# Altium project TruckCape v4.PrjPCB
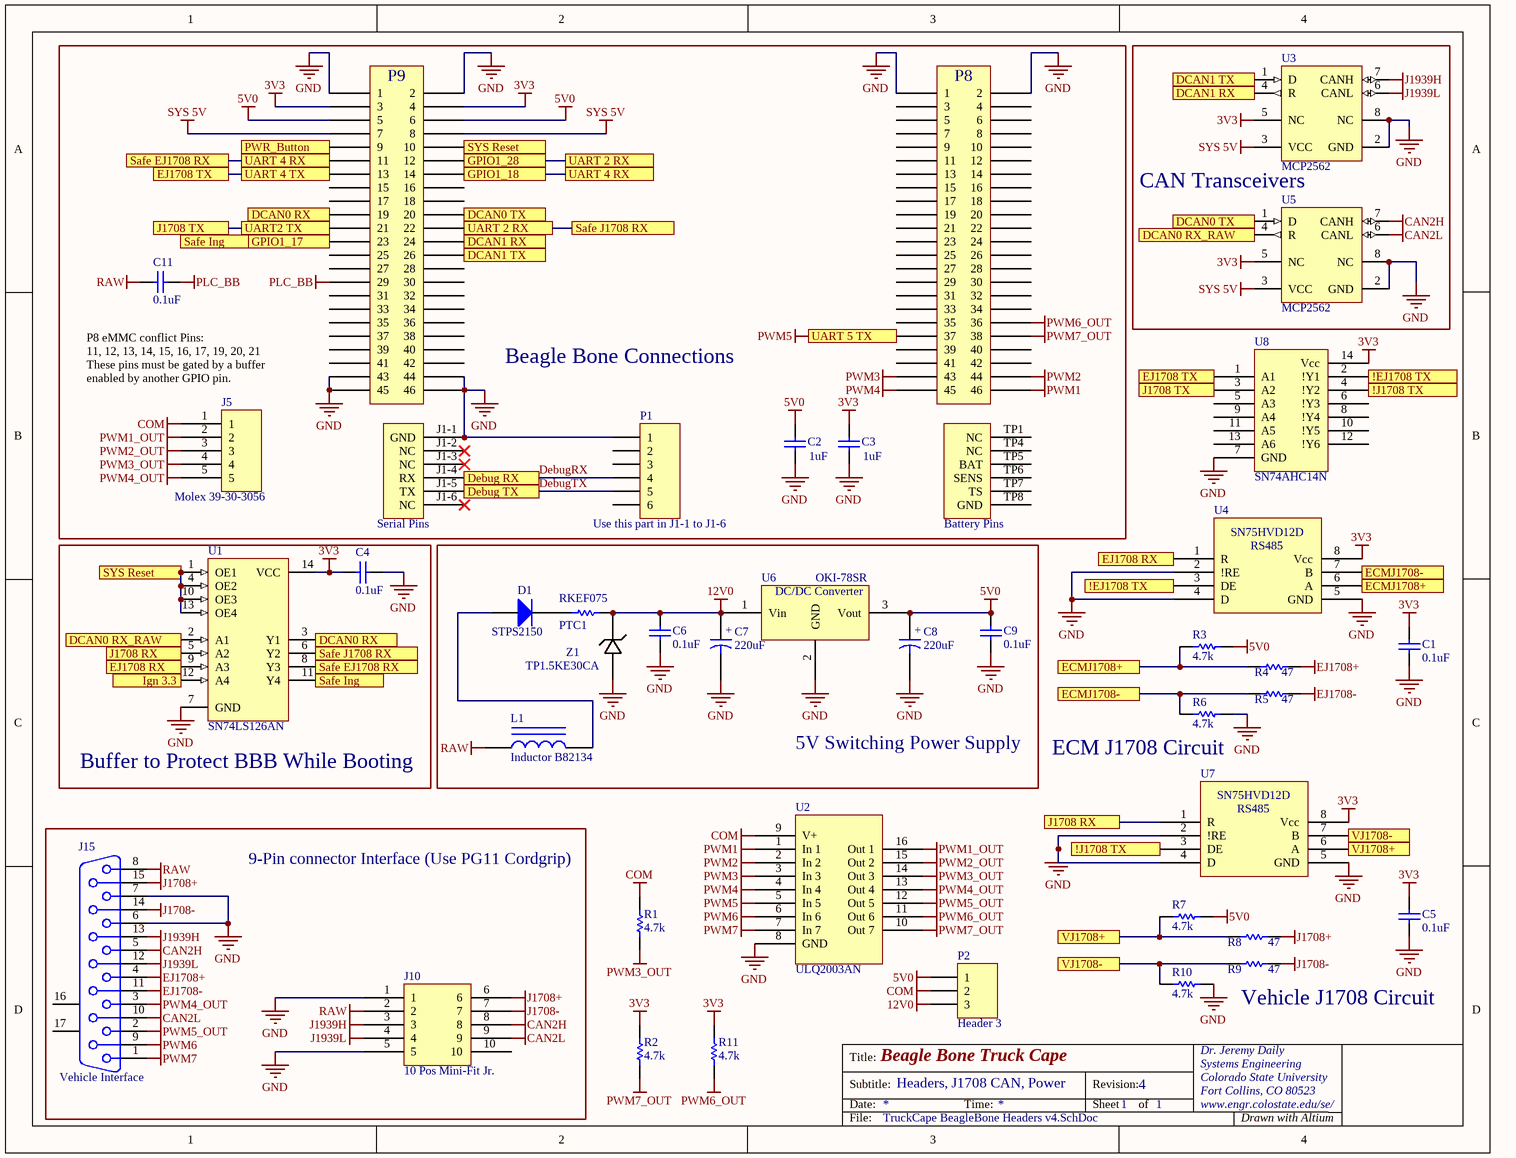
[diagram p0: TruckCape BeagleBone Headers v4.SchDoc]
1 sheet, 39 parts. Net scope: flat (ports and power ports of the same name join across sheets).
Board file: TruckCape for Hammond 1455K - Rev4.PcbDoc

## Sheet TruckCape BeagleBone Headers v4.SchDoc: Beagle Bone Truck Cape
size Letter; Author: Dr. Jeremy Daily; CompanyName: Colorado State University; Organization: Dr. Jeremy Daily; Address1: Systems Engineering; Address2: Colorado State University; Address3: Fort Collins, CO 80523; Address4: www.engr.colostate.edu/se/; DocumentNumber: Headers, J1708 CAN, Power; Revision: 4; SheetNumber: 1; SheetTotal: 1; ProjectName: NSF EAGER Testbed

### Parts
BeagleBoneBlack1  BeagleBoneBlack  [Beagleboneblack]  (value not drawn)
C1  0.1uF  [CAPR5-4X5]
C2  1uF  [CAPR5-4X5]
C3  1uF  [CAPR5-4X5]
C4  0.1uF  [CAPR5-4X5]
C5  0.1uF  [CAPR5-4X5]
C6  0.1uF  [CAPR5-4X5]
C7  220uF  [Elec. Cap 5 x 10mm]
C8  220uF  [Elec. Cap 5 x 10mm]
C9  0.1uF  [CAPR5-4X5]
C11  0.1uF  [CAPR5-4X5]
D1  STPS2150  [DO-41]
J5  Molex 39-30-3056  [5 POS MINI-FIT JR R/A Header]
J10  10 Pos Mini-Fit Jr.  [10 pos Mini-Fit Jr. R/A Header]
J15  Vehicle Interface  [DB15]
L1  Inductor B82134  [AXIAL-0.9]
P1  Use this part in J1-1 to J1-6  [HDR1X6]
P2  Header 3  [HDR1X3]
PTC1  RKEF075  [PTC]
R1  4.7k  [Axial-0.4]
R2  4.7k  [Axial-0.4]
R3  4.7k  [Axial-0.4]
R4  47  [Axial-0.4]
R5  47  [Axial-0.4]
R6  4.7k  [Axial-0.4]
R7  4.7k  [Axial-0.4]
R8  47  [Axial-0.4]
R9  47  [Axial-0.4]
R10  4.7k  [Axial-0.4]
R11  4.7k  [Axial-0.4]
U1  SN74LS126AN  [N14A]
U2  ULQ2003AN  [DIP16]
U3  MCP2562  [PDIP300-P8]
U4  SN75HVD12  [PDIP300-P8]  (value not drawn)
U5  MCP2562  [PDIP300-P8]
U6  OKI-78SR  [OKI-78SR]
U7  SN75HVD12  [PDIP300-P8]  (value not drawn)
U8  SN74AHC14N  [N14A]
Z1  TP1.5KE30CA  [DIODE-0.7]

### Blocks framed on the sheet
Beagle Bone Connections: BeagleBoneBlack1 C2 C3 C11 J5 P1
CAN Transceivers: U3 U5
Buffer to Protect BBB While Booting: C4 U1
5V Switching Power Supply: C6-C9 D1 L1 PTC1 U6 Z1
9-Pin connector Interface (Use PG11 Cordgrip): J10 J15

### Ports
!EJ1708 TX, !J1708 TX, DCAN0 RX, DCAN0 RX_RAW, DCAN0 TX, DCAN1 RX, DCAN1 TX, Debug RX, Debug TX, ECMJ1708+, ECMJ1708-, EJ1708 RX, EJ1708 TX, GPIO1_17, GPIO1_18, GPIO1_28, Ign 3.3, J1708 RX, J1708 TX, PWR_Button, Safe EJ1708 RX, Safe Ing, Safe J1708 RX, SYS Reset, UART2 TX, UART 2 RX, UART 4 RX, UART 4 TX, UART 5 TX, VJ1708+, VJ1708-

### Nets
3V3: BeagleBoneBlack1.3 BeagleBoneBlack1.4 C1.2 C3.1 C4.1 C5.2 R2.2 R11.2 U1.14(VCC) U3.5(NC) U4.8(Vcc) U5.5(NC) U7.8(Vcc) U8.14(Vcc)
5V0: BeagleBoneBlack1.5 BeagleBoneBlack1.6 C2.1 C8.1 C9.2 P2.1 R3.2 R7.2 U6.3(Vout)
12V0: C6.2 C7.1 P2.3 PTC1.2 U6.1(Vin) Z1.2(K)
CAN2H: J10.8 J15.5 U5.7(CANH)
CAN2L: J10.9 J15.10 U5.6(CANL)
COM: J5.1 P2.2 R1.2 U2.9(V+)
EJ1708+: J15.4 R4.2
EJ1708-: J15.11 R5.2
GND: BeagleBoneBlack1.1 BeagleBoneBlack1.2 BeagleBoneBlack1.43 BeagleBoneBlack1.44 BeagleBoneBlack1.45 BeagleBoneBlack1.46 BeagleBoneBlack1.J1-1(GND) BeagleBoneBlack1.P1(1) BeagleBoneBlack1.P2(2) C1.1 C2.2 C3.2 C4.2 C5.1 C6.1 C7.2(-) C8.2(-) C9.1 J10.1 J10.5 J15.6 J15.7 P1.1 R6.2 R10.2 U1.7(GND) U2.8(GND) U3.2(GND) U3.8(NC) U4.2(!RE) U4.4(D) U4.5(GND) U5.2(GND) U5.8(NC) U6.2(GND) U7.2(!RE) U7.4(D) U7.5(GND) U8.7(GND) Z1.1(A)
J1708+: J10.6 J15.15 R8.2
J1708-: J10.7 J15.14 R9.2
J1939H: J10.3 J15.13 U3.7(CANH)
J1939L: J10.4 J15.12 U3.6(CANL)
PLC_BB: BeagleBoneBlack1.29 C11.2
PWM1: BeagleBoneBlack1.P46(46) U2.1(In_1)
PWM1_OUT: J5.2 U2.16(Out_1)
PWM2: BeagleBoneBlack1.P44(44) U2.2(In_2)
PWM2_OUT: J5.3 U2.15(Out_2)
PWM3: BeagleBoneBlack1.P43(43) U2.3(In_3)
PWM3_OUT: J5.4 R1.1 U2.14(Out_3)
PWM4: BeagleBoneBlack1.P45(45) U2.4(In_4)
PWM4_OUT: J5.5 J15.3 U2.13(Out_4)
PWM5: BeagleBoneBlack1.P37(37) U2.5(In_5) ; port UART 5 TX
PWM5_OUT: J15.2 U2.12(Out_5)
PWM6: J15.9 U2.6(In_6)
PWM6_OUT: BeagleBoneBlack1.P36(36) R11.1 U2.11(Out_6)
PWM7: J15.1 U2.7(In_7)
PWM7_OUT: BeagleBoneBlack1.P38(38) R2.1 U2.10(Out_7)
RAW: C11.1 J10.2 J15.8 L1.1
SYS 5V: BeagleBoneBlack1.7 BeagleBoneBlack1.8 U3.3(VCC) U5.3(VCC)
DebugRX: BeagleBoneBlack1.J1-4(RX) P1.4 ; port Debug RX
DebugTX: BeagleBoneBlack1.J1-5(TX) P1.5 ; port Debug TX
NetBeagleBoneBlack1_9: BeagleBoneBlack1.9 ; port PWR_Button
NetBeagleBoneBlack1_10: BeagleBoneBlack1.10 U1.1(OE1) U1.4(OE2) U1.10(OE3) U1.13(OE4) ; port SYS Reset
NetBeagleBoneBlack1_11: BeagleBoneBlack1.11 BeagleBoneBlack1.14 U1.8(Y3) ; port UART 4 RX, port GPIO1_18, port Safe EJ1708 RX
NetBeagleBoneBlack1_12: BeagleBoneBlack1.12 BeagleBoneBlack1.22 U1.6(Y2) ; port GPIO1_28, port UART 2 RX, port Safe J1708 RX
NetBeagleBoneBlack1_13: BeagleBoneBlack1.13 U8.1(A1) ; port UART 4 TX, port EJ1708 TX
NetBeagleBoneBlack1_19: BeagleBoneBlack1.19 U1.3(Y1) ; port DCAN0 RX
NetBeagleBoneBlack1_20: BeagleBoneBlack1.20 U5.1(D) ; port DCAN0 TX
NetBeagleBoneBlack1_21: BeagleBoneBlack1.21 U8.3(A2) ; port UART2 TX, port J1708 TX
NetBeagleBoneBlack1_23: BeagleBoneBlack1.23 U1.11(Y4) ; port GPIO1_17, port Safe Ing
NetBeagleBoneBlack1_24: BeagleBoneBlack1.24 U3.4(R) ; port DCAN1 RX
NetBeagleBoneBlack1_26: BeagleBoneBlack1.26 U3.1(D) ; port DCAN1 TX
NetD1_1: D1.1(A) L1.2
NetD1_2: D1.2(K) PTC1.1
NetR3_1: R3.1 R4.1 U4.6(A) ; port ECMJ1708+
NetR5_1: R5.1 R6.1 U4.7(B) ; port ECMJ1708-
NetR7_1: R7.1 R8.1 U7.6(A) ; port VJ1708+
NetR9_1: R9.1 R10.1 U7.7(B) ; port VJ1708-
NetU1_2: U1.2(A1) U5.4(R) ; port DCAN0 RX_RAW
NetU1_5: U1.5(A2) U7.1(R) ; port J1708 RX
NetU1_9: U1.9(A3) U4.1(R) ; port EJ1708 RX
NetU1_12: U1.12(A4) ; port Ign 3.3
NetU4_3: U4.3(DE) U8.2(!Y1) ; port !EJ1708 TX
NetU7_3: U7.3(DE) U8.4(!Y2) ; port !J1708 TX

Not connected (* = marked no-connect by the designer): BeagleBoneBlack1 15 16 17 18 25 27 28 30 31 32 33 34 35 36 37 38 39 40 41 42 J1-2(NC)* J1-3(NC)* J1-6(NC)* P3(3) P4(4) P5(5) P6(6) P7(7) P8(8) P9(9) P10(10) P11(11) P12(12) P13(13) P14(14) P15(15) P16(16) P17(17) P18(18) P19(19) P20(20) P21(21) P22(22) P23(23) P24(24) P25(25) P26(26) P27(27) P28(28) P29(29) P30(30) P31(31) P32(32) P33(33) P34(34) P35(35) P39(39) P40(40) P41(41) P42(42) TP1(NC) TP4(NC) TP5(BAT) TP6(SENS) TP7(TS) TP8(GND); J10 10; J15 16(MH1) 17(MH2); P1 2 3 6; U8 5(A3) 6(!Y3) 8(!Y4) 9(A4) 10(!Y5) 11(A5) 12(!Y6) 13(A6)

### Notes on the sheet
- (near J5) P8 eMMC conflict Pins:
  11, 12, 13, 14, 15, 16, 17, 19, 20, 21
  These pins must be gated by a buffer enabled by another GPIO pin.
- (near R6) ECM J1708 Circuit
- (near R9) Vehicle J1708 Circuit
- Title:
- Subtitle:
- Date:
- Time:
- Revision:
- Sheet
- of
- File:
- Drawn with Altium
- (in symbol 7805) DC/DC Converter
- (in symbol BeagleBoneBlack) Serial Pins; Battery Pins
- (in symbol Electrolytic Cap) +
- (in symbol SN75HVD12D (3.3v RS485)) SN75HVD12D; RS485

### Library data of the parts
BeagleBoneBlack1 = BeagleBoneBlack: 46 Positions Header, Breakaway Connector 0.100" (2.54mm) Through Hole Tin; Manufacturer: Sullins Connector Solutions; PartNumber: PREC023DAAN-RC; Supplier 1: Digi-Key; Supplier Part Number 1: S2012EC-23-ND
C1 C4-C6 C9 C11 = Cap: CAP CER 0.1UF 100V X7R RADIAL; Manufacturer: Vishay BC Components; PartNumber: K104K20X7RH53H5; Supplier 1: Digi-Key; Supplier Part Number 1: BC5139-ND
C2 C3 = Cap: CAP CER 1UF 100V X7R RADIAL; Manufacturer: Murata Electronics North America; PartNumber: RDER72A105K2M1H03A; Supplier 1: Digi-Key; Supplier Part Number 1: 490-9198-1-ND
C7 C8 = Electrolytic Cap: 220µF 50V Aluminum Electrolytic Capacitors Radial, Can 175 mOhm @ 10kHz 5000 Hrs @ 105°C; Manufacturer: EPCOS (TDK); PartNumber: B41858C6227M000; Supplier 1: Digi-Key; Supplier Part Number 1: 495-6000-ND
D1 = Diode 1N4003: Diode Schottky 150V 2A Through Hole DO-15; Manufacturer: STMicroelectronics; PartNumber: STPS2150; Supplier 1: Digi-Key; Supplier Part Number 1: 497-3213-1-ND
J5 = 5 Pos Header: 5 Positions Header Connector 0.165" (4.20mm) Through Hole - Right Angle Tin; Manufacturer: Molex; Supplier 1: Digi-Key; PartNumber: 39-30-3055; Supplier Part Number 1: WM18448-ND
J10 = 10 Pos Header: 10 Positions Header Connector 0.165" (4.20mm) Through Hole - Right Angle Tin; Manufacturer: Molex; Supplier 1: Digi-Key; PartNumber: 39-30-1100; Supplier Part Number 1: WM1355-ND
J15 = 788781-2: Receptacle Assembly, 15 Position, Right Angle, 8.08mm Series, Amplimite, with Screwlocks; Manufacturer: Amphenol FCI; PartNumber: D15S33E4GX00LF; Supplier 1: Digi-Key; Supplier Part Number 1: 609-1499-ND
L1 = Inductor Iron: Magnetic-Core Inductor; Manufacturer: TDK Electronics Inc.; PartNumber: B82134A5701M000; Supplier 1: Digi-Key; Supplier Part Number 1: 495-76036-1-ND
P1 = Header 6: CONN HEADER FEMALE 6POS .1" GOLD; Manufacturer: Sullins Connector Solutions; PartNumber: PPPC061LFBN-RC; Supplier 1: Digi-Key; Supplier Part Number 1: S7039-ND
P2 = Header 3: 2 (1 x 2) Position Shunt Connector Black Open Top 0.100" (2.54mm) Gold; Manufacturer: Sullins Connector Solutions; PartNumber: QPC02SXGN-RC; Supplier 1: Digi-Key; Supplier Part Number 1: S9337-ND
PTC1 = SMD Resistor: Polymeric PTC Resettable Fuse 60V 750mA Ih Through Hole Radial, Disc; Manufacturer: Littelfuse Inc.; Supplier 1: Digi-Key; PartNumber: RKEF075; Supplier Part Number 1: RKEF075HF-ND
R1-R3 R6 R7 R10 R11 = Chip Resistor: RES SMD 4.7K OHM 1% 1/10W 0603; Manufacturer: Yageo; PartNumber: CFR-25JB-52-4K7; Supplier 1: Digi-Key; Supplier Part Number 1: 4.7KQBK-ND
R4 R5 R8 R9 = Chip Resistor: 47 Ohms ±5% 0.25W, 1/4W Through Hole Resistor Axial  Carbon Film; Manufacturer: Yageo; PartNumber: CFR-25JB-52-47R; Supplier 1: Digi-Key; Supplier Part Number 1: 47QBK-ND
U1 = DM74LS126AN: Quad 3-State Buffer; Manufacturer: Texas Instruments; PartNumber: SN74LS126AN; Supplier 1: Digi-Key; Supplier Part Number 1: 296-3643-5-ND
U2 = ULQ2003: High voltage, high current Darlington arrays each containing seven open collector Darlington pairswith common emitters.; Manufacturer: Texas Instruments; PartNumber: ULQ2003AN; Supplier 1: Digi-Key; Supplier Part Number 1: 296-22623-5-ND
U3 U5 = SN65HVD232DR: 1/1 Transceiver Half CAN 8-PDIP; Manufacturer: Microchip Technology; PartNumber: MCP2562-E/P; Supplier 1: Digi-Key; Supplier Part Number 1: MCP2562-E/P-ND; Footprint: SN65HVD232
U4 U7 = SN75HVD12D (3.3v RS485): IC 3.3V DIFF TXRX 8-SOIC; Manufacturer: Texas Instruments; PartNumber: SN75HVD12P; Supplier 1: Digi-Key; Supplier Part Number 1: 296-14047-5-ND
U6 = 7805: 5V DC/DC Converter (7805 replacement); Manufacturer: Murata Power Solutions Inc.; PartNumber: OKI-78SR-5/1.5-W36H-C; Supplier 1: Digi-Key; Supplier Part Number 1: 811-2692-ND
U8 = 74VHC14 Hex Inverter: Inverter IC 6 Channel Schmitt Trigger 14-PDIP; Manufacturer: Texas Instruments; Supplier 1: Digi-Key; Supplier Part Number 1: 296-4550-5-ND; PartNumber: SN74AHC14N
Z1 = Zener: TVS DIODE 25.6V 41.4V DO201; Manufacturer: Littelfuse Inc.; Supplier 1: Digi-Key; Supplier Part Number 1: F7610CT-ND; PartNumber: TP1.5KE30CA